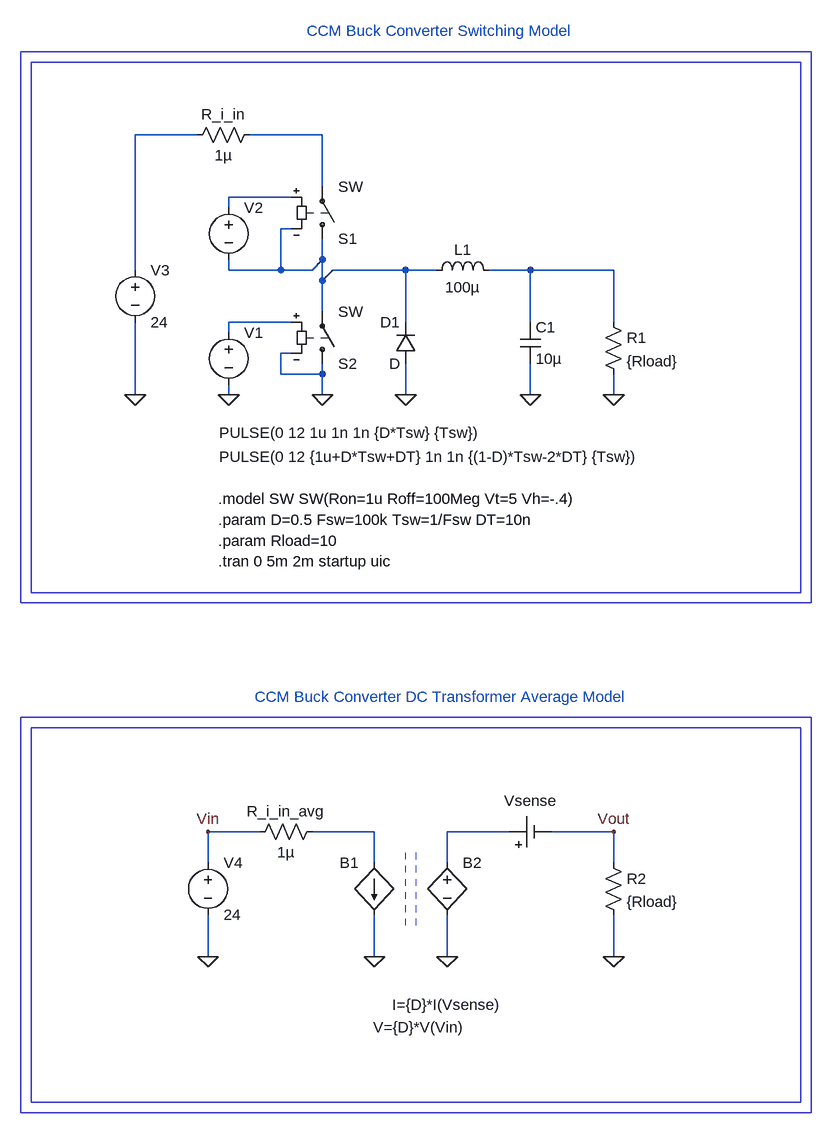
[diagram p0: schematic Buck Converter.asc]
Buck Converter.asc, the LTspice schematic file:
Version 4
SHEET 1 2484 1700
WIRE 80 48 -16 48
WIRE 272 48 160 48
WIRE 272 128 272 48
WIRE 224 144 128 144
WIRE 128 160 128 144
WIRE 224 192 208 192
WIRE 272 240 272 208
WIRE -16 256 -16 48
WIRE 128 256 128 240
WIRE 208 256 208 192
WIRE 208 256 128 256
WIRE 256 256 272 240
WIRE 256 256 208 256
WIRE 400 256 288 256
WIRE 448 256 400 256
WIRE 592 256 528 256
WIRE 720 256 592 256
WIRE 272 272 272 240
WIRE 272 272 288 256
WIRE 272 320 272 272
WIRE 224 336 128 336
WIRE 400 336 400 256
WIRE 592 336 592 256
WIRE 720 336 720 256
WIRE 128 352 128 336
WIRE 224 384 208 384
WIRE 208 416 208 384
WIRE 272 416 272 400
WIRE 272 416 208 416
WIRE -16 448 -16 336
WIRE 128 448 128 432
WIRE 272 448 272 416
WIRE 400 448 400 400
WIRE 592 448 592 400
WIRE 720 448 720 416
WIRE 176 1120 96 1120
WIRE 352 1120 256 1120
WIRE 560 1120 464 1120
WIRE 720 1120 624 1120
WIRE 96 1168 96 1120
WIRE 352 1168 352 1120
WIRE 464 1168 464 1120
WIRE 720 1168 720 1120
WIRE 96 1312 96 1248
WIRE 352 1312 352 1248
WIRE 464 1312 464 1248
WIRE 720 1312 720 1248
FLAG 592 448 0
FLAG 720 448 0
FLAG 272 448 0
FLAG 400 448 0
FLAG 128 448 0
FLAG -16 448 0
FLAG 96 1312 0
FLAG 352 1312 0
FLAG 464 1312 0
FLAG 720 1312 0
FLAG 96 1120 Vin
FLAG 720 1120 Vout
SYMBOL sw 272 224 M180
SYMATTR InstName S1
SYMBOL sw 272 416 M180
SYMATTR InstName S2
SYMBOL ind 432 272 R270
WINDOW 0 32 56 VTop 2
WINDOW 3 5 56 VBottom 2
SYMATTR InstName L1
SYMATTR Value 100µ
SYMBOL cap 576 336 R0
SYMATTR InstName C1
SYMATTR Value 10µ
SYMBOL res 704 320 R0
SYMATTR InstName R1
SYMATTR Value {Rload}
SYMBOL voltage 128 336 R0
WINDOW 3 -15 207 Left 2
WINDOW 123 0 0 Left 0
WINDOW 39 0 0 Left 0
SYMATTR Value PULSE(0 12 {1u+D*Tsw+DT} 1n 1n {(1-D)*Tsw-2*DT} {Tsw})
SYMATTR InstName V1
SYMBOL voltage 128 144 R0
WINDOW 3 -15 362 Left 2
WINDOW 123 0 0 Left 0
WINDOW 39 0 0 Left 0
SYMATTR Value PULSE(0 12 1u 1n 1n {D*Tsw} {Tsw})
SYMATTR InstName V2
SYMBOL diode 416 400 R180
WINDOW 0 24 64 Left 2
WINDOW 3 24 0 Left 2
SYMATTR InstName D1
SYMBOL voltage -16 240 R0
WINDOW 123 0 0 Left 0
WINDOW 39 0 0 Left 0
SYMATTR InstName V3
SYMATTR Value 24
SYMBOL res 64 64 R270
WINDOW 0 32 56 VTop 2
WINDOW 3 0 56 VBottom 2
SYMATTR InstName R_i_in
SYMATTR Value 1µ
SYMBOL bi 352 1168 M0
WINDOW 3 -195 218 Left 2
SYMATTR Value I={D}*I(Vsense)
SYMATTR InstName B1
SYMBOL bv 464 1152 R0
WINDOW 3 -114 269 Left 2
SYMATTR Value V={D}*V(Vin)
SYMATTR InstName B2
SYMBOL voltage 96 1152 R0
WINDOW 123 0 0 Left 0
WINDOW 39 0 0 Left 0
SYMATTR InstName V4
SYMATTR Value 24
SYMBOL res 160 1136 R270
WINDOW 0 32 56 VTop 2
WINDOW 3 0 56 VBottom 2
SYMATTR InstName R_i_in_avg
SYMATTR Value 1µ
SYMBOL Misc\\cell 560 1120 R270
WINDOW 0 32 32 VTop 2
WINDOW 3 -32 32 VBottom 2
SYMATTR InstName Vsense
SYMATTR Value ""
SYMBOL res 704 1152 R0
SYMATTR InstName R2
SYMATTR Value {Rload}
TEXT 112 608 Left 2 !.model SW SW(Ron=1u Roff=100Meg Vt=5 Vh=-.4)
TEXT 112 640 Left 2 !.param D=0.5 Fsw=100k Tsw=1/Fsw DT=10n
TEXT 112 704 Left 2 !.tran 0 5m 2m startup uic
TEXT 248 -112 Left 2 ;CCM Buck Converter Switching Model
TEXT 168 912 Left 2 ;CCM Buck Converter DC Transformer Average Model
TEXT 112 672 Left 2 !.param Rload=10
LINE Normal 400 1264 400 1152 1
LINE Normal 416 1264 416 1152 1
RECTANGLE Normal 1008 752 -176 -64
RECTANGLE Normal 1024 768 -192 -80
RECTANGLE Normal 1008 1536 -176 960
RECTANGLE Normal 1024 1552 -192 944

The netlist it stands for:
* Buck Converter.asc
S1 N004 N002 N003 N004 SW
S2 0 N004 N006 0 SW
L1 N004 N005 100µ
C1 N005 0 10µ
R1 N005 0 {Rload}
V1 N006 0 PULSE(0 12 {1u+D*Tsw+DT} 1n 1n {(1-D)*Tsw-2*DT} {Tsw})
V2 N003 N004 PULSE(0 12 1u 1n 1n {D*Tsw} {Tsw})
D1 0 N004 D
V3 N001 0 24
R_i_in N001 N002 1µ
B1 N007 0 I={D}*I(Vsense)
B2 N008 0 V={D}*V(Vin)
V4 Vin 0 24
R_i_in_avg Vin N007 1µ
Vsense N008 Vout
R2 Vout 0 {Rload}
.model D D
.lib standard.dio
.model SW SW(Ron=1u Roff=100Meg Vt=5 Vh=-.4)
.param D=0.5 Fsw=100k Tsw=1/Fsw DT=10n
.tran 0 5m 2m startup uic
* CCM Buck Converter Switching Model
* CCM Buck Converter DC Transformer Average Model
.param Rload=10
.backanno
.end